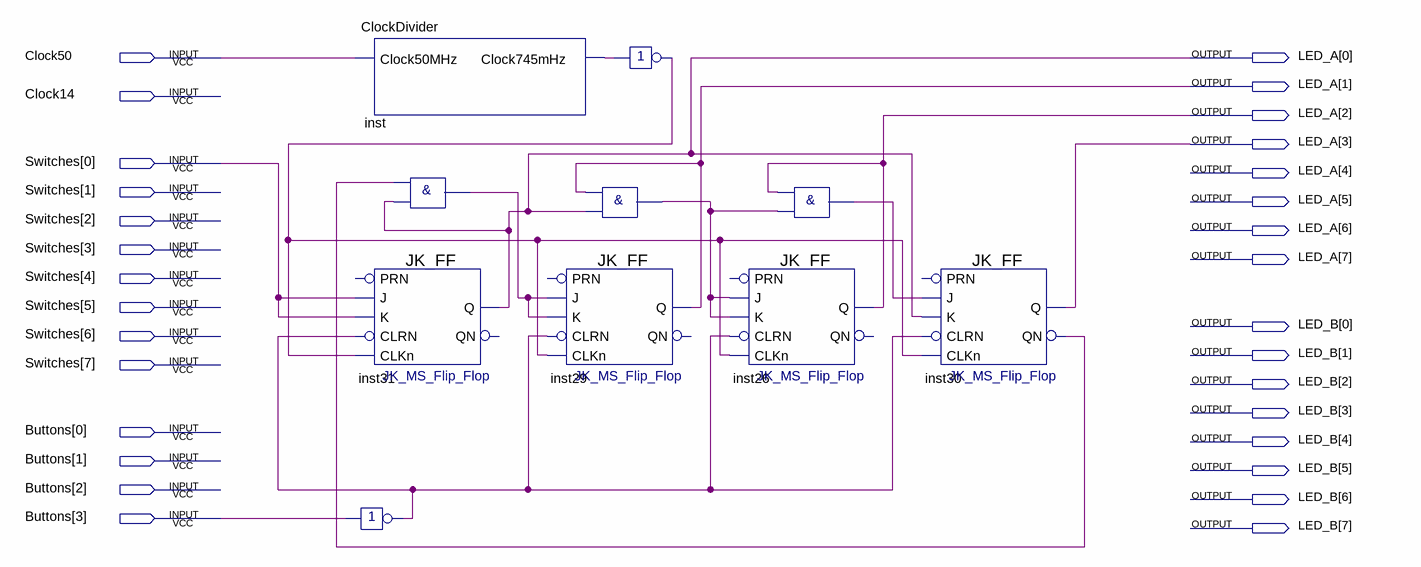
[diagram p0: schematic sheet]
// Quartus schematic SynchronerDezimalzaehler.bdf as structural Verilog: 10 symbols, 30 pins
module SynchronerDezimalzaehler (
  input  Clock50,
  input  Clock14,
  input  [7:0] Switches,
  input  [3:0] Buttons,
  output [7:0] LED_A,
  output [7:0] LED_B
);

  wire inst23_out, inst24_out, inst25_out, inst27_out, inst28_out, inst30_qn, inst_clock745mhz;

  ClockDivider inst (.Clock50MHz(Clock50), .Clock745mHz(inst_clock745mhz));
  and inst23 (inst23_out, inst30_qn, LED_A[0]);
  JK_FF inst31 (.K(Switches[0]), .J(Switches[0]), .CLRN(inst27_out), .CLKn(inst28_out), .Q(LED_A[0]));  // open: PRN, QN
  not inst27 (inst27_out, Buttons[3]);
  JK_FF inst29 (.K(inst23_out), .J(inst23_out), .CLRN(inst27_out), .CLKn(inst28_out), .Q(LED_A[1]));  // open: PRN, QN
  not inst28 (inst28_out, inst_clock745mhz);
  and inst25 (inst25_out, LED_A[1], LED_A[0]);
  and inst24 (inst24_out, LED_A[2], inst25_out);
  JK_FF inst26 (.K(inst25_out), .J(inst25_out), .CLRN(inst27_out), .CLKn(inst28_out), .Q(LED_A[2]));  // open: PRN, QN
  JK_FF inst30 (
    .K(LED_A[0]), .J(inst24_out), .CLRN(inst27_out), .CLKn(inst28_out), .QN(inst30_qn), .Q(LED_A[3]));  // open: PRN
endmodule
